# EAGLE board Rephone core 2G-AtmelSAMD21 v1.0 (EAGLE 6.4), part 1 of 2
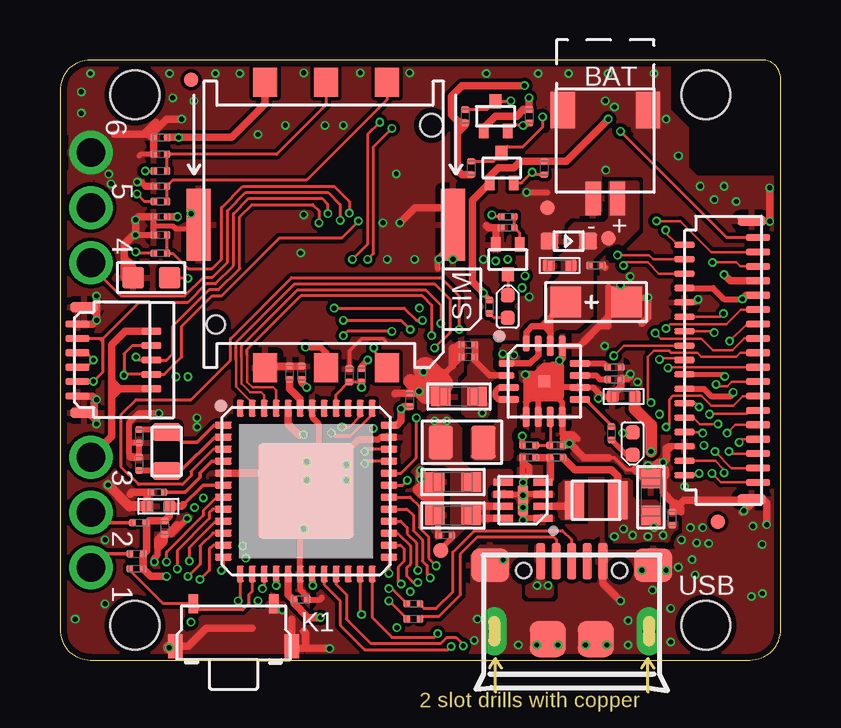
[diagram p2: board, top side]
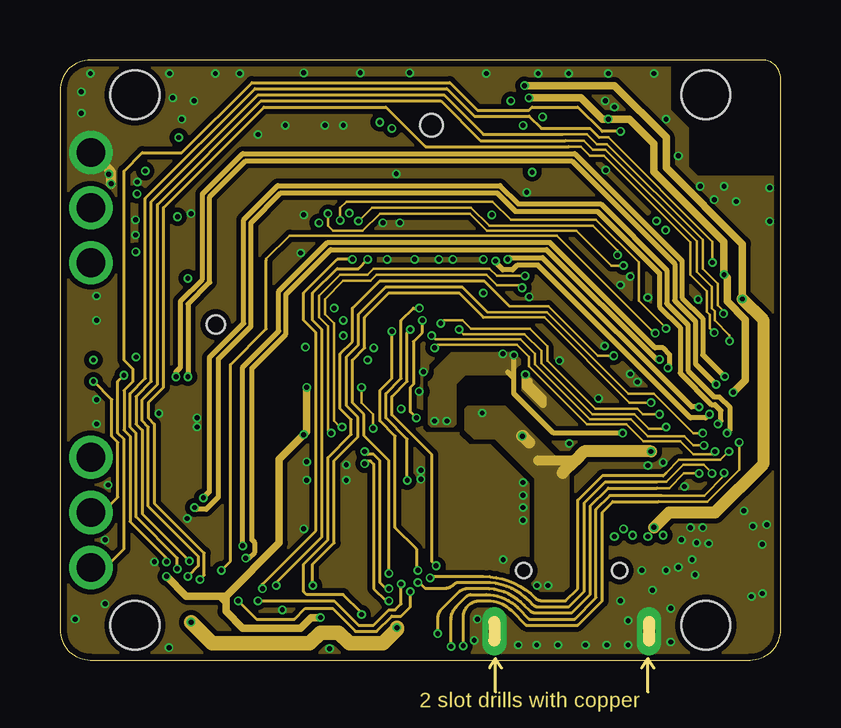
[diagram p3: board, inner layer Route2]
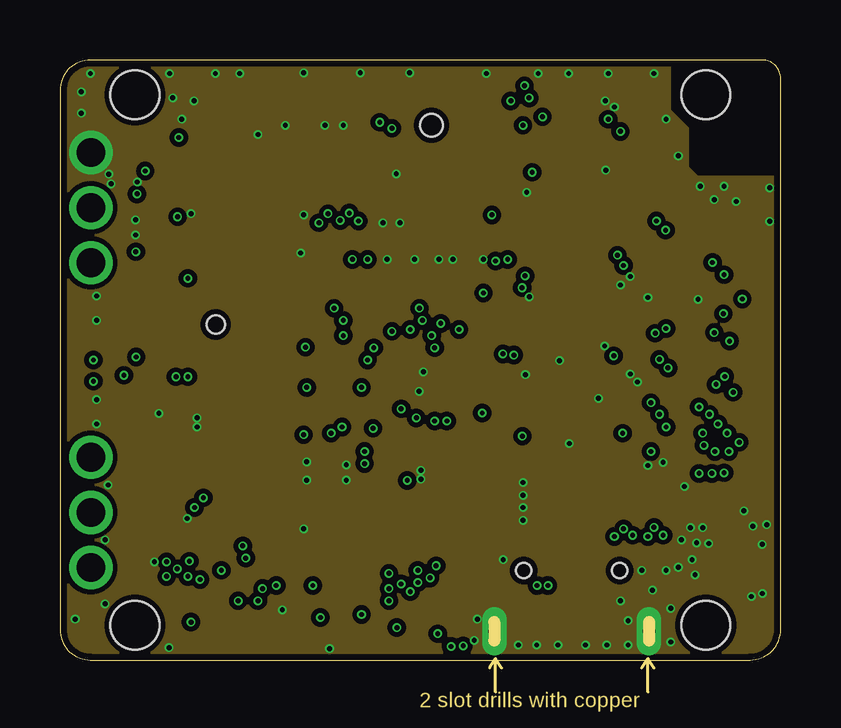
[diagram p4: board, inner layer GND]
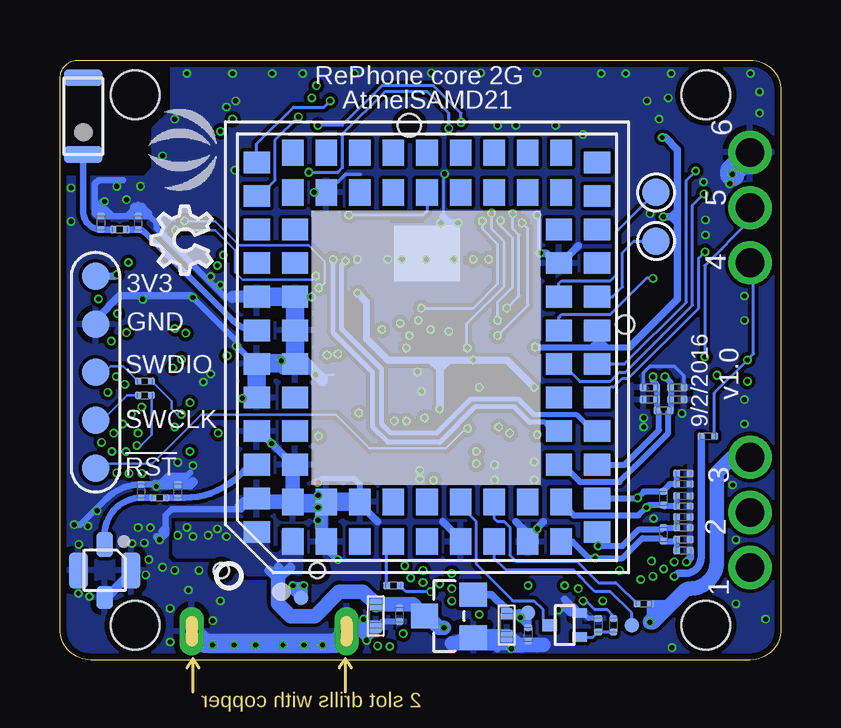
[diagram p5: board, bottom side, seen from below]

Size 30.05 x 25 mm. Coordinates in mm from the lower left corner, seen from the top.
Outline: 1.27,25 arc90 0,23.73 0,1.27 arc90 1.27,0 28.78,0 arc90 30.05,1.27 30.05,24.24 arc90 29.29,25 1.27,25
Copper layers (1*2*15*16): Top 0.035mm / dielectric 0.2mm / Route2 0.0175mm / dielectric 0.3mm / GND 0.0175mm / dielectric 0.2mm / Bottom 0.035mm
Design rules "SeeedStudio_4layer_DRU_no_angle_20140221 *": minimum track width 1mil, minimum drill 8mil, track to track 4mil, track to pad 4mil, pad to pad 5mil, via to via 5mil, smd to smd 0mil, copper to edge 10mil, drill to drill 6mil, minimum pad ring 4mil, minimum via ring 3mil, stop-mask expansion 2mil, vias tented up to drill 100mil, thermal gap 10mil
Holes 2.03 mm at 3.12,1.45 3.12,23.55 26.92,23.55 26.92,1.45
tRestrict: area 26.7,20.5 to 31.1,25.6; area 7.1,4 to 13.3,10.1; area 19.6,9.8 to 19.7,10.3; area 3.9,8.6 to 4.4,8.8
bRestrict: area 26.7,20.5 to 31.1,25.6

## Footprints (pad centres in the part's own frame; a part is rotated, then mirrored left to right if it is on the bottom)
ANT-SMD2P-3.2X1.6X1.04MM = smd 1.6 x 0.7: 1 0,1.6; 2 0,-1.6
C0201 = smd 0.279 x 0.318: 1 -0.279,0; 2 0.279,0
C0603 = smd 0.8 x 0.8: 1 0,0.762; 2 0,-0.762
C0402 = smd 0.508 x 0.508: 1 0,0.457; 2 0,-0.457
AVX-A = smd 1.27 x 1.27: + -1.27,0; - 1.27,0
C0603' = smd 0.889 x 0.889: 1 0,0.762; 2 0,-0.762
SOD-523 = smd 0.762 x 0.7: + -0.8,0; - 0.8,0
LED-0402 = smd 0.58 x 0.58: + -0.468,0; - 0.468,0
ANT-IPEX4-1.7X1.7MM = smd 0.7 x 1.05: 1 0,-1.075 | smd 0.8 x 1.5: 2 1.1,0; 4 -1.1,0 | smd 0.7 x 0.95: 3 0,1.125
MICRO-USB5+4P-SMD-0.65-B = smd 0.381 x 1.524: 1 -1.3,-0.25; 2 -0.65,-0.25; 3 0,-0.25; 4 0.65,-0.25; 5 1.3,-0.25 | smd 1.6 x 1.397: S1 -3.4,-0.427; S6 3.4,-0.427 | drill 0.508 pad 1.016 long: S2 -3.226,-3.175; S5 3.226,-3.175 | smd 1.5 x 1.5: S3 -1,-3.5; S4 1,-3.5 | hole 0.635: -2,-0.65; 2,-0.65
HW2-SMD-1.0-90D = smd 1.524 x 1.016: 3 -3.429,1.778; 4 -3.429,-1.778 | smd 1.397 x 0.635: + 0.254,0.508; - 0.254,-0.508
FPC35-SMD-0.3(FH26W) = smd 0.3 x 1: 1 -5.1,-1.551; 3 -4.5,-1.551; 5 -3.9,-1.551; 7 -3.3,-1.551; 9 -2.7,-1.551; 11 -2.1,-1.551; 13 -1.5,-1.551; 15 -0.9,-1.551; 17 -0.3,-1.551; 19 0.3,-1.551; 21 0.9,-1.551; 23 1.5,-1.551; 25 2.1,-1.551; 27 2.7,-1.551; 29 3.3,-1.551; 31 3.9,-1.551; 33 4.5,-1.551; 35 5.1,-1.551 | smd 0.254 x 0.851: 2 -4.8,1.524; 4 -4.2,1.524; 6 -3.6,1.524; 8 -3,1.524; 10 -2.4,1.524; 12 -1.8,1.524; 14 -1.2,1.524; 16 -0.6,1.524; 18 0,1.524; 20 0.6,1.524; 22 1.2,1.524; 24 1.8,1.524; 26 2.4,1.524; 28 3,1.524; 30 3.6,1.524; 32 4.2,1.524; 34 4.8,1.524 | smd 0.4 x 1.15: P$1 5.8,-1.276; P$2 -5.8,-1.276
FPC11-SMD-0.3(FH35C) = smd 0.3 x 1: 1 -1.5,-3.075; 3 -0.9,-3.075; 5 -0.3,-3.075; 7 0.3,-3.075; 9 0.9,-3.075; 11 1.5,-3.075 | smd 0.3 x 0.85: 2 -1.2,0; 4 -0.6,0; 6 0,0; 8 0.6,0; 10 1.2,0 | smd 0.4 x 1.15: P$1 2.2,-2.8; P$2 -2.2,-2.8
3P-DIP-2 = drill 1.2 pad 1.8: 1 -2.3,-0.02; 2 0,-0.02; 3 2.3,-0.02
H5-SMD-2.0-TEST = smd 1.143 x 1.143: 1 0,4; 2 0,2; 3 0,0; 4 0,-2; 5 0,-4
SW4-SMD-4.5X3.8X1.8MM-90D = smd 0.4 x 0.8: 1 -1.675,-1.277; 2 1.675,-1.277 | smd 0.6 x 1: S1 -2.425,0.5; S2 2.425,0.5
L0805 = smd 1.016 x 1.397: 1 -0.889,0; 2 0.889,0
L201610 = smd 0.8 x 1.6: 1 -0.9,0; 2 0.9,0
SOT-523 = smd 0.4 x 0.6: 1 0.5,0.62; 2 -0.5,0.62 | smd 0.5 x 0.6: 3 0,-0.62
R0201 = smd 0.279 x 0.318: 1 -0.279,0; 2 0.279,0
NANO-SIM6+2P-SMD-12.3X10X1.5MM = smd 1 x 1.2: 1 6.94,-1.8; 2 4.4,-1.8; 3 1.86,-1.8; 5 6.94,10.1; 6 4.4,10.1; 7 1.86,10.1 | smd 1 x 3: 4 9.71,4.15; 8 -0.9,4.15 | hole 0.95: 0,0 | hole 0.75: 9,8.3
TP-D23MIL = smd 0.6 x 0.6: T 0,0
TP-D45MIL = smd 1.143 x 1.143: T 0,0
QFN16GA-0.5-3X3MM = smd 0.65 x 0.28: 1 -1.575,0.75; 2 -1.575,0.25 | smd 0.85 x 0.28: 3 -1.475,-0.25; 4 -1.475,-0.75; 9 1.475,-0.75; 10 1.475,-0.25; 11 1.475,0.25; 12 1.475,0.75 | smd 0.28 x 0.85: 5 -0.75,-1.475; 6 -0.25,-1.475; 7 0.25,-1.475; 8 0.75,-1.475; 13 0.75,1.475; 14 0.25,1.475 | smd 0.28 x 0.65: 15 -0.25,1.575; 16 -0.75,1.575 | smd 0.508 x 0.508: PAD 0,0
DFN8G-0.5-2X2MM = smd 0.8 x 0.3: 1 -0.827,0.75; 2 -0.827,0.25; 3 -0.827,-0.25; 4 -0.827,-0.75; 5 0.827,-0.75; 6 0.827,-0.25; 7 0.827,0.25; 8 0.827,0.75 | smd 0.45 x 1.3: 9 0,0
SOT-23 = smd 1.016 x 1.143: 1 -0.889,-1.016; 2 0.889,-1.016; 3 0,1.016
QFN48-7X7 = smd 0.7 x 0.3: 1 -3.45,2.75; 2 -3.45,2.25; 3 -3.45,1.75; 4 -3.45,1.25; 5 -3.45,0.75; 6 -3.45,0.25; 7 -3.45,-0.25; 8 -3.45,-0.75; 9 -3.45,-1.25; 10 -3.45,-1.75; 11 -3.45,-2.25; 12 -3.45,-2.75; 25 3.45,-2.75; 26 3.45,-2.25; 27 3.45,-1.75; 28 3.45,-1.25; 29 3.45,-0.75; 30 3.45,-0.25; 31 3.45,0.25; 32 3.45,0.75; 33 3.45,1.25; 34 3.45,1.75; 35 3.45,2.25; 36 3.45,2.75 | smd 0.3 x 0.7: 13 -2.75,-3.45; 14 -2.25,-3.45; 15 -1.75,-3.45; 16 -1.25,-3.45; 17 -0.75,-3.45; 18 -0.25,-3.45; 19 0.25,-3.45; 20 0.75,-3.45; 21 1.25,-3.45; 22 1.75,-3.45; 23 2.25,-3.45; 24 2.75,-3.45; 37 2.75,3.45; 38 2.25,3.45; 39 1.75,3.45; 40 1.25,3.45; 41 0.75,3.45; 42 0.25,3.45; 43 -0.25,3.45; 44 -0.75,3.45; 45 -1.25,3.45; 46 -1.75,3.45; 47 -2.25,3.45; 48 -2.75,3.45 | smd 4 x 4: PAD 0,0
GPRS88-SMD-1.4-17.8X45.8X2.4MM = smd 1.1 x 0.9: 1 -8.1,5.6; 2 -8.1,4.2; 3 -8.1,2.8; 4 -8.1,1.4; 5 -8.1,0; 6 -8.1,-1.4; 7 -8.1,-2.8; 8 -8.1,-4.2; 9 -8.1,-5.6; 22 8.1,-5.6; 23 8.1,-4.2; 24 8.1,-2.8; 25 8.1,-1.4; 26 8.1,0; 27 8.1,1.4; 28 8.1,2.8; 29 8.1,4.2; 30 8.1,5.6; 43 -6.45,5.6; 44 -6.45,4.2; 45 -6.45,2.8; 46 -6.45,1.4; 47 -6.45,0; 48 -6.45,-1.4; 49 -6.45,-2.8; 50 -6.45,-4.2; 51 -6.45,-5.6; 60 6.45,-5.6; 61 6.45,-4.2; 62 6.45,-2.8; 63 6.45,-1.4; 64 6.45,0; 65 6.45,1.4; 66 6.45,2.8; 67 6.45,4.2; 68 6.45,5.6 | smd 0.9 x 1.1: 10 -7.7,-7.1; 11 -6.3,-7.1; 12 -4.9,-7.1; 13 -3.5,-7.1; 14 -2.1,-7.1; 15 -0.7,-7.1; 16 0.7,-7.1; 17 2.1,-7.1; 18 3.5,-7.1; 19 4.9,-7.1; 20 6.3,-7.1; 21 7.7,-7.1; 31 7.7,7.1; 32 6.3,7.1; 33 4.9,7.1; 34 3.5,7.1; 35 2.1,7.1; 36 0.7,7.1; 37 -0.7,7.1; 38 -2.1,7.1; 39 -3.5,7.1; 40 -4.9,7.1; 41 -6.3,7.1; 42 -7.7,7.1; 52 -4.9,-5.5; 53 -3.5,-5.5; 54 -2.1,-5.5; 55 -0.7,-5.5; 56 0.7,-5.5; 57 2.1,-5.5; 58 3.5,-5.5; 59 4.9,-5.5; 69 4.9,5.5; 70 3.5,5.5; 71 2.1,5.5; 72 0.7,5.5; 73 -0.7,5.5; 74 -2.1,5.5; 75 -3.5,5.5; 76 -4.9,5.5 | smd 2.3 x 2.7: 83 3.9,0
X2-SMD-L2.0X1.2X0.55MM = smd 0.762 x 1.143: 1 -0.813,0; 2 0.813,0

## Placement (x,y rotation side)
BT  AN3216  [ANT-SMD2P-3.2X1.6X1.04MM]  29.08,22.66 180 bottom
C1  100nF  [C0201]  17.02,12.63 180 top
C2  10uF  [C0603]  16.64,10.98 270 top
C3  10uF  [C0603]  16.38,7.42 270 top
C4  1uF  [C0402]  20.83,16.44 270 top
C5  100nF  [C0201]  22.35,16.44 0 top
C6  22uF  [AVX-A]  22.35,14.91 0 top
C7  1uF  [C0402]  23.5,10.98 270 top
C8  100nF  [C0201]  16.07,5.2 0 top
C9  10uF  [C0603]  16.38,6.02 90 top
C10  100nF  [C0201]  25.53,5.9 270 top
C11  22uF  [C0603]  24.64,6.79 0 top
C12  100nF  [C0201]  15.9,1.88 90 bottom
C13  1uF  [C0402]  16.89,1.83 180 bottom
C14  100nF  [C0201]  10.54,1.07 90 bottom
C15  1uF  [C0402]  11.43,1.45 180 bottom
C16  10pF  [C0201]  4.32,11.36 0 bottom
C17  10pF  [C0201]  5.46,10.85 180 bottom
C18  1uF  [C0402]  4.1,6.4 90 top
C19  100nF  [C0201]  4.06,6.99 0 top
C20  100nF  [C0201]  10.08,11.97 90 top
C21  100nF  [C0201]  4.37,5.51 90 top
C22  100nF  [C0201]  9.58,11.97 90 top
C23  100nF  [C0201]  12.07,11.87 90 top
C24  100nF  [C0201]  14.58,10.84 90 top
C25  100nF  [C0201]  10.03,2.52 180 top
C26  4.7uF  [C0603']  3.81,15.93 270 top
C27  33pF  [C0201]  4.32,10.85 0 bottom
C28  10pF  [C0201]  4.89,10.39 0 bottom
C29  33pF  [C0201]  5.46,11.36 180 bottom
C30  33pF  [C0201]  4.06,5.02 0 bottom
C31  10pF  [C0201]  4.9,5.24 270 bottom
C32  33pF  [C0201]  4.06,5.96 0 bottom
C33  33pF  [C0201]  4.06,6.84 0 bottom
C34  10pF  [C0201]  4.9,6.73 270 bottom
C35  33pF  [C0201]  4.06,7.33 0 bottom
C36  100nF  [C0201]  4.19,21.77 180 top
C37  100nF  [C0201]  4.19,18.47 180 top
C38  27pF  [C0201]  4.19,21.07 0 top
C39  27pF  [C0201]  4.19,19.74 0 top
C40  27pF  [C0201]  4.19,17.71 0 top
C41  10pF  [C0201]  4.06,4.56 0 bottom
C42  10pF  [C0201]  4.06,5.51 0 bottom
C43  10pF  [C0201]  4.06,6.4 0 bottom
C44  10pF  [C0201]  4.06,7.78 0 bottom
C45  12pF  [C0201]  3.3,8.18 270 top
C46  12pF  [C0201]  3.3,9.32 90 top
D1  Prisemi;PZ5D4V2H  [SOD-523]  21.21,17.45 0 top
D2  Green  [LED-0402]  23.88,9.02 270 top
D3  BLue  [LED-0402]  18.67,14.72 90 top
FR1  [SEEEDSTUDIO-PCB-FRAME]  -84.07,-77.92 0 top  (outside the outline)
FR2  [SEEEDSTUDIO-PCB-FRAME]  -84.58,-84.53 0 top  (outside the outline)
FR3  [SEEEDSTUDIO-PCB-FRAME]  -85.09,-91.13 0 top  (outside the outline)
FR4  [SEEEDSTUDIO-PCB-FRAME]  -85.6,-97.74 0 top  (outside the outline)
FR5  [SEEEDSTUDIO-PCB-FRAME]  -86.11,-104.34 0 top  (outside the outline)
GSM  IPEX  [ANT-IPEX4-1.7X1.7MM]  28.19,3.74 180 bottom
J1  Micro-USB  [MICRO-USB5+4P-SMD-0.65-B]  21.34,4.37 0 top
J2  SMD FEMALE JST;2P-1.0-90D  [HW2-SMD-1.0-90D]  22.73,19.48 270 top
J3  FH26-35S-0.3SHW  [FPC35-SMD-0.3(FH26W)]  27.56,12.5 90 top
J4  FH35C-11S-0.3SHW(50)  [FPC11-SMD-0.3(FH35C)]  3.81,12.5 270 top
J5  DNP  [3P-DIP-2]  1.27,18.85 90 top
J6  DNP  [3P-DIP-2]  1.27,6.15 90 top
J7  DNP  [H5-SMD-2.0-TEST]  28.58,11.99 0 bottom
K1  BUTTON-2P-REINFORCE;HQ-TP-1100A  [SW4-SMD-4.5X3.8X1.8MM-90D]  7.24,1.07 180 top
L1  2.2uH  [L0805]  16.76,9.07 180 top
L2  0.47uH  [L201610]  22.35,6.66 0 top
Q1  CJ1012  [SOT-523]  9.02,1.45 270 bottom
Q2  CJ1012  [SOT-523]  18.67,16.69 0 top
Q3  CJ1012  [SOT-523]  18.41,20.5 180 top
Q4  CJ1012  [SOT-523]  18.16,22.66 180 top
R1  1M  [R0201]  17.02,13.13 180 top
R2  22R  [R0201]  14.73,1.71 180 top
R3  22R  [R0201]  14.73,2.34 180 top
R4  2k  [R0201]  23.11,12.2 0 top
R5  2k  [R0201]  23.11,11.69 0 top
R6  DNP  [R0201]  19.56,8.94 180 top
R7  2k  [R0201]  22.99,9.45 90 top
R8  0R  [R0201]  20.7,8.94 0 top
R9  220k_1%  [R0201]  20.7,8.44 0 top
R10  39k_1%  [R0201]  19.56,8.44 0 top
R12  10k  [R0201]  12.57,11.87 270 top
R13  4.7k  [R0201]  3.3,5.72 0 top
R14  4.7k  [R0201]  3.2,4.42 0 top
R15  4.7k  [R0201]  3.05,9.32 0 bottom
R16  0R  [R0201]  26.52,11.61 0 bottom
R17  0R  [R0201]  26.52,11.03 0 bottom
R18  4.7k  [R0201]  3.19,3.8 180 top
R19  4.7k  [R0201]  6.98,1.45 270 bottom
R20  47k  [R0201]  7.62,1.45 90 bottom
R21  4.7k  [R0201]  5.71,2.34 0 bottom
R22  DNP  [C0201]  28.35,18.21 270 bottom
R23  DNP  [C0201]  26.8,18.21 270 bottom
R24  0R  [R0201]  27.56,17.94 180 bottom
R25  0R  [R0201]  25.91,6.76 180 bottom
R26  DNP  [C0201]  26.67,7.04 90 bottom
R27  DNP  [C0201]  25.15,7.04 90 bottom
R28  4.7k  [R0201]  16.15,3.1 0 bottom
R29  4.7k  [R0201]  18.67,18.47 0 top
R30  47k  [R0201]  18.67,18.01 180 top
R31  4.7k  [R0201]  20.19,20.5 270 top
R32  4.7k  [R0201]  17.91,14.72 90 top
R33  4.7k  [R0201]  17.14,20.5 90 top
R34  4.7k  [R0201]  19.56,22.66 270 top
R35  4.7k  [R0201]  16.89,22.66 90 top
R36  51R  [R0201]  4.19,20.37 0 top
R37  51R  [R0201]  4.19,19.1 0 top
R38  51R  [R0201]  4.19,16.95 180 top
SIM  Nano SIM CARD CONNECTOR 6Pin SMT TYPE  [NANO-SIM6+2P-SMD-12.3X10X1.5MM]  15.49,22.28 180 top
TP1  [TP-D23MIL]  20.02,2.59 0 bottom
TP2  [TP-D23MIL]  15.88,4.56 0 top
TP3  [TP-D23MIL]  10.54,1.96 0 bottom
TP4  [TP-D23MIL]  27.43,5.77 0 top
TP5  [TP-D23MIL]  5.46,24.18 0 top
TP6  [TP-D45MIL]  5.21,19.48 90 bottom
TP7  [TP-D45MIL]  5.21,17.45 90 bottom
TP8  [TP-D23MIL]  6.22,1.45 90 bottom
TP9  [TP-D23MIL]  22.86,17.58 270 top
TP10  [TP-D23MIL]  20.32,18.85 270 top
U1  ETA6003  [QFN16GA-0.5-3X3MM]  20.19,11.61 0 top
U2  ETA3410  [DFN8G-0.5-2X2MM]  19.3,6.66 180 top
U3  AP7333-33SRG  [SOT-23]  13.84,1.83 90 bottom
U4  MCU-ATSAMD21-QFN48  [QFN48-7X7]  10.26,7.04 0 top
U5  SIM800H  [GPRS88-SMD-1.4-17.8X45.8X2.4MM]  14.76,13.03 90 bottom
U$2  [SEEED-SILK-160*153MIL]  25.04,21.29 90 bottom
U$14  [OSHW_FILLX100_NOTEXT]  23.72,16.08 90 bottom
X1  32.768KHz  [X2-SMD-L2.0X1.2X0.55MM]  4.45,8.69 270 top